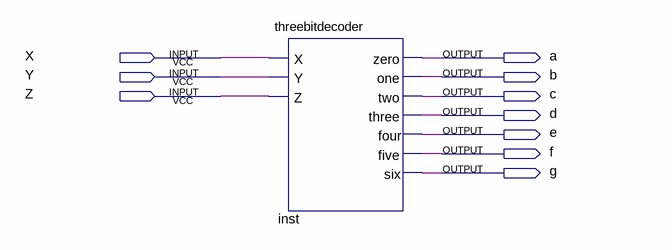
[diagram p0: schematic sheet]
// Quartus schematic Block1.bdf as structural Verilog: 1 symbols, 10 pins
module Block1 (
  input  X,
  input  Y,
  input  Z,
  output a,
  output b,
  output c,
  output d,
  output e,
  output f,
  output g
);

  threebitdecoder inst (.X(X), .Y(Y), .Z(Z), .zero(a), .one(b), .two(c), .three(d), .four(e), .five(f), .six(g));
endmodule
